# Altium schematic sheet Flash.SchDoc
size A4; SheetNumber: 5; SheetTotal: 13
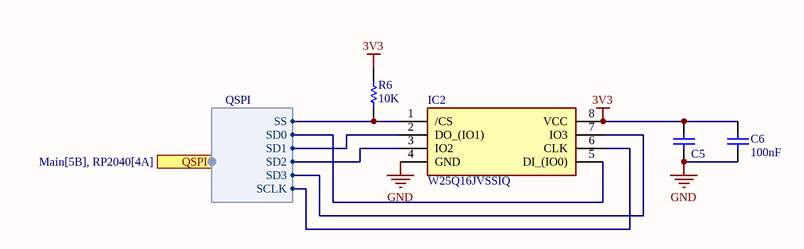
[diagram p0: Flash.SchDoc]

## Parts
C5  100nF  [WCAP-CSGP_0603_L1.6W0.8H0.8_Reflow]  (value not drawn)
C6  100nF  [0402 cap]
IC2  W25Q16JVSSIQ  [SOIC127P790X216-8N]
R6  10K  [RESC0603(1608)_N]

## Ports
QSPI (harness QSPI, see Main[5B], RP2040[4A])

## Harnesses
QSPI: SS, SD0, SD1, SD2, SD3, SCLK

## Nets
3V3: C5.2 C6.2 IC2.8(VCC) R6.2
GND: C5.1 C6.1 IC2.4(GND)
NetIC2_1: IC2.1(/CS) R6.1 ; port QSPI.SS
NetIC2_2: IC2.2(DO_(IO1)) ; port QSPI.SD1
NetIC2_3: IC2.3(IO2) ; port QSPI.SD2
NetIC2_5: IC2.5(DI_(IO0)) ; port QSPI.SD0
NetIC2_6: IC2.6(CLK) ; port QSPI.SCLK
NetIC2_7: IC2.7(IO3) ; port QSPI.SD3

## Library data of the parts
C5 = 885012206095: WCAP-CSGP Multilayer Ceramic Chip Capacitor, General Purpose, size 0603, X7R, 100nF, 50VDC; Manufacturer: Wurth Elektronik; Case/Size Code: 0603; Capacitance Tolerance: +/-10%; Dissipation Factor: 3%; Insulation Resistance: 5GΩ; Rated Voltage (DC): 50V; Technical Reference: X7R0603104K050DFCT10000; Manufacturer Part Number: 885012206095; Category: Multilayer Ceramic Chip Capacitors; Match Code: WCAP-CSGP; ComponentLink1Description: Website Link; ComponentLink1URL: https://www.we-online.com/redexpert/article/885012206095?ad; ComponentLink2Description: Datasheet Link; ComponentLink2URL: https://www.we-online.com/redexpert/spec/885012206095?ad; Mount: Surface Mount; Operating Temperature Max: 125°C; Operating Temperature Min: -55°C; Packaging: Tape and Reel; Length: 1.6mm; Width: 0.8mm; Height: 0.8mm; Capacitance: 100nF; Ceramic Type: X7R
C6 = Capacitor 0402 100nF: Value: 100nF
IC2 = W25Q16JVSSIQ: Integrated Circuit; Manufacturer_Name: Winbond; Datasheet Link: https://www.winbond.com/hq/search-resource-file.jsp?partNo=W25Q16JVSSIQ&type=datasheet; Height: 2.16mm; Manufacturer_Part_Number: W25Q16JVSSIQ; Mouser Part Number: 454-W25Q16JVSSIQ; Mouser Price/Stock: https://www.mouser.co.uk/ProductDetail/Winbond/W25Q16JVSSIQ?qs=qSfuJ%252Bfl%2Fd46L%2F1QrQC%2Fog%3D%3D; Arrow Part Number: W25Q16JVSSIQ; Arrow Price/Stock: https://www.arrow.com/en/products/w25q16jvssiq/winbond-electronics?region=nac
R6 = Res 10K: Chipwiderstand, SMD, Baureihe MC, 1%; Manufacturer: Multicomp; PackageReference: 0603; Value: 10K; OC_FARNELL: 9330399